# Altium schematic sheet [07] - POWER.SchDoc: DOCUMENT TITLE
size A4; Organization: Tor Brodtkorb; Address1: Frode Rinnans veg 193; Address2: 7050 Trondheim; DocumentNumber: 6598; Revision: 1.0; SheetNumber: 1; SheetTotal: 1
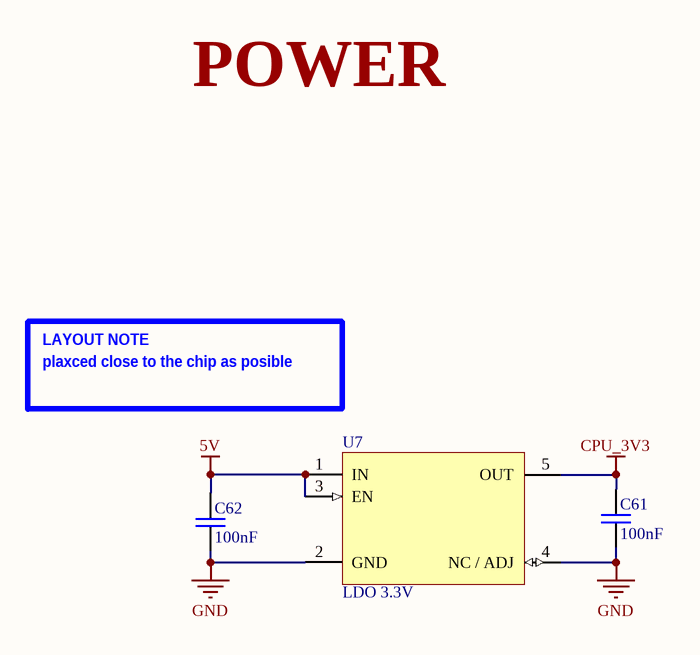
[diagram p0: [07] - POWER.SchDoc]

## Parts
C61  value 100nF  [C0603]  (hidden comment: 02016D104KAT2A)
C62  value 100nF  [C0603]  (hidden comment: 02016D104KAT2A)
U7  LDO 3.3V  [NCV8161BSN330T1G]

## Nets
5V: C62.2 U7.1(IN) U7.3(EN)
CPU_3V3: C61.2 U7.5(OUT)
GND: C61.1 C62.1 U7.2(GND) U7.4(NC_/_ADJ)

## Notes on the sheet
- POWER
- LAYOUT NOTE
- plaxced close to the chip as posible
- Title
- Size:
- Date:
- A4
- Number:
- Time:
- Revision:
- Sheet
- of
- File:

## Library data of the parts
C61 C62 = 02016D104KAT2A: C0603
U7 = NCV8161BSN330T1G: LDO fixed 3.3V 450mA ultra-low noise; RMS noise: < 100 uVrms; Dropout voltage: 330mV; Supplier Part Number 1: 2775470; Supplier 1: Farnell; Output voltage: 3.3V; Output current: 450mA